# EAGLE design Christmas Tree 2.1 (EAGLE 9.6.2)
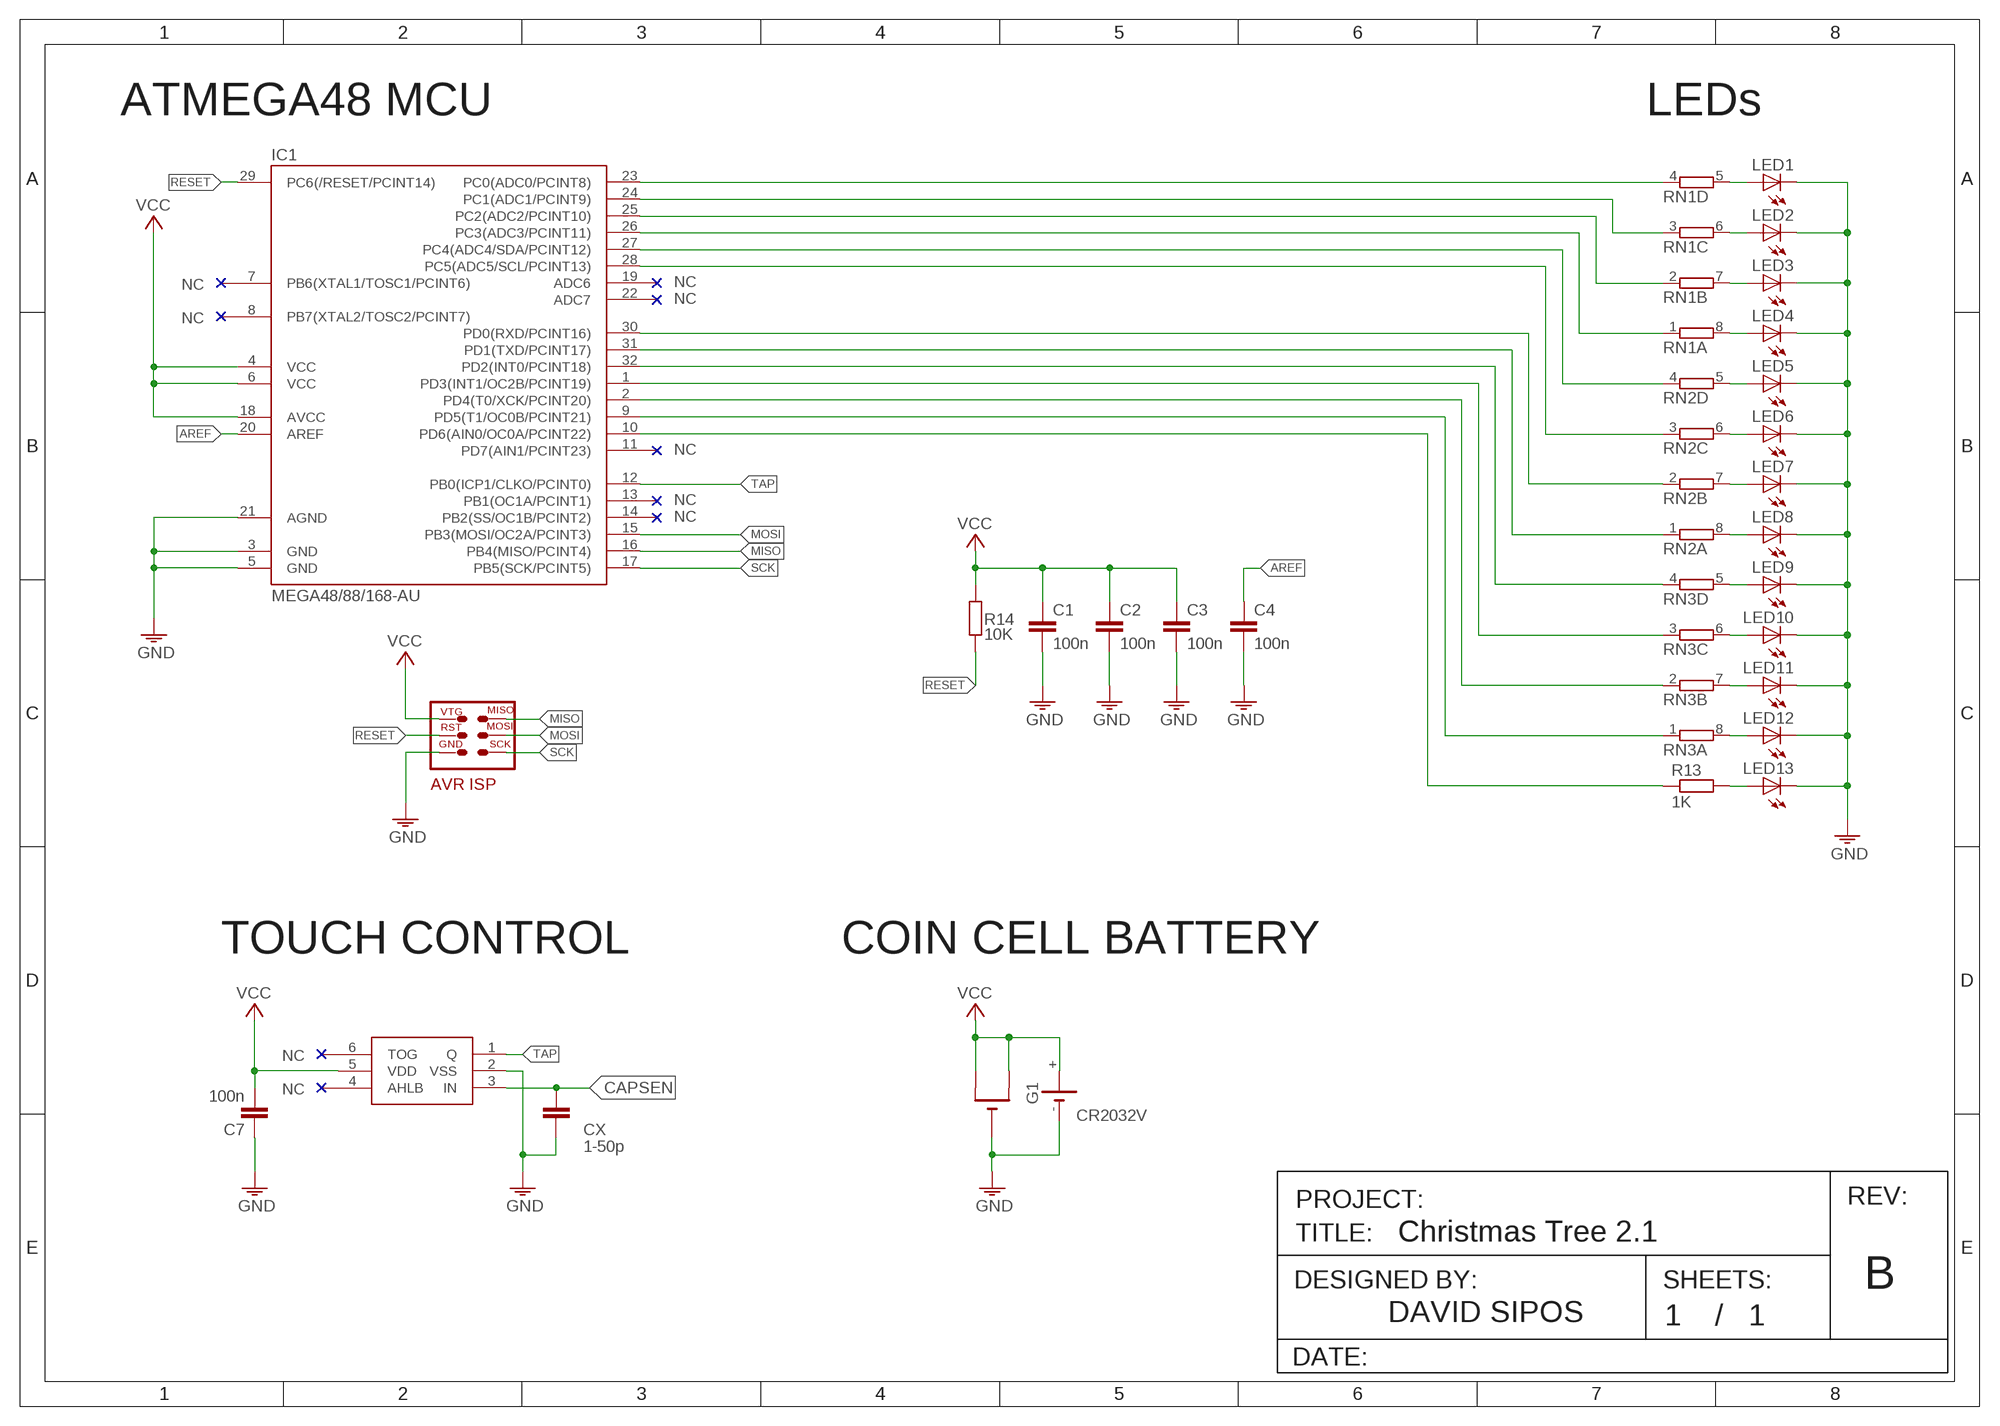
[diagram p0: schematic, sheet 1]

## Parts
BAT  CR2032SMT  [CR2032-SMD]
C1  100n  C-EUC0402K  [C0402K]
C2  100n  C-EUC0402K  [C0402K]
C3  100n  C-EUC0402K  [C0402K]
C4  100n  C-EUC0402K  [C0402K]
C7  100n  C-EUC0402K  [C0402K]
CX  1-50p  C-EUC0402K  [C0402K]
G1  CR2032V  [CR2032V]
IC1  MEGA48/88/168-AU  [TQFP32-08]
LED1  LEDCHIPLED_0805  [CHIPLED_0805]
LED2  LEDCHIPLED_0805  [CHIPLED_0805]
LED3  LEDCHIPLED_0805  [CHIPLED_0805]
LED4  LEDCHIPLED_0805  [CHIPLED_0805]
LED5  LEDCHIPLED_0805  [CHIPLED_0805]
LED6  LEDCHIPLED_0805  [CHIPLED_0805]
LED7  LEDCHIPLED_0805  [CHIPLED_0805]
LED8  LEDCHIPLED_0805  [CHIPLED_0805]
LED9  LEDCHIPLED_0805  [CHIPLED_0805]
LED10  LEDCHIPLED_0805  [CHIPLED_0805]
LED11  LEDCHIPLED_0805  [CHIPLED_0805]
LED12  LEDCHIPLED_0805  [CHIPLED_0805]
LED13  LEDCHIPLED_0805  [CHIPLED_0805]
R13  1K  R-EU_R0402  [R0402]
R14  10K  R-EU_R0402  [R0402]
RN1  4R-N0603-ARC  [0603-ARC]
RN2  4R-N0603-ARC  [0603-ARC]
RN3  4R-N0603-ARC  [0603-ARC]
TTP223E1  TTP223E  [SOT23-6]
U$12  ISP  [ISP]

## Nets
AREF: C4.1 IC1.20(AREF)
CAPSEN: CX.2 TTP223E1.3(IN)
GND: BAT.- C1.2 C2.2 C3.2 C4.2 C7.1 CX.1 G1.- IC1.3(GND) IC1.5(GND) IC1.21(AGND) LED1.C LED2.C LED3.C LED4.C LED5.C LED6.C LED7.C LED8.C LED9.C LED10.C LED11.C LED12.C LED13.C TTP223E1.2(VSS) U$12.6
MISO: IC1.16(PB4(MISO/PCINT4)) U$12.1
MOSI: IC1.15(PB3(MOSI/OC2A/PCINT3)) U$12.4
N$1: LED1.A RN1.5
N$2: LED2.A RN1.6
N$3: LED3.A RN1.7
N$4: LED4.A RN1.8
N$5: LED5.A RN2.5
N$6: LED6.A RN2.6
N$7: LED7.A RN2.7
N$8: LED8.A RN2.8
N$9: LED9.A RN3.5
N$10: LED10.A RN3.6
N$11: LED11.A RN3.7
N$12: LED12.A RN3.8
N$13: LED13.A R13.2
N$18: IC1.23(PC0(ADC0/PCINT8)) RN1.4
N$19: IC1.24(PC1(ADC1/PCINT9)) RN1.3
N$20: IC1.25(PC2(ADC2/PCINT10)) RN1.2
N$21: IC1.26(PC3(ADC3/PCINT11)) RN1.1
N$22: IC1.27(PC4(ADC4/SDA/PCINT12)) RN2.4
N$23: IC1.28(PC5(ADC5/SCL/PCINT13)) RN2.3
N$24: IC1.30(PD0(RXD/PCINT16)) RN2.2
N$25: IC1.31(PD1(TXD/PCINT17)) RN2.1
N$26: IC1.32(PD2(INT0/PCINT18)) RN3.4
N$27: IC1.1(PD3(INT1/OC2B/PCINT19)) RN3.3
N$28: IC1.2(PD4(T0/XCK/PCINT20)) RN3.2
N$29: IC1.9(PD5(T1/OC0B/PCINT21)) RN3.1
N$30: IC1.10(PD6(AIN0/OC0A/PCINT22)) R13.1
RESET: IC1.29(PC6(/RESET/PCINT14)) R14.1 U$12.5
SCK: IC1.17(PB5(SCK/PCINT5)) U$12.3
TAP: IC1.12(PB0(ICP1/CLKO/PCINT0)) TTP223E1.1(Q)
VCC: BAT.+$1(+) BAT.+$2(+1) C1.1 C2.1 C3.1 C7.2 G1.+ G1.+@1(+) IC1.4(VCC) IC1.6(VCC) IC1.18(AVCC) R14.2 TTP223E1.5(VDD) U$12.2
Unconnected: IC1.7(PB6(XTAL1/TOSC1/PCINT6)) IC1.8(PB7(XTAL2/TOSC2/PCINT7)) IC1.11(PD7(AIN1/PCINT23)) IC1.13(PB1(OC1A/PCINT1)) IC1.14(PB2(SS/OC1B/PCINT2)) IC1.19(ADC6) IC1.22(ADC7) TTP223E1.4(AHLB) TTP223E1.6(TOG)

## Notes on the sheet
- ATMEGA48 MCU | LEDs
- TOUCH CONTROL | COIN CELL BATTERY
- B

## Library data of the parts
BAT = adafruit:CR2032
C1-C4 C7 CX = rcl:C-EU: CAPACITOR, European symbol; SPICEPREFIX: C
G1 = battery:CR2032V: LI BATTERY Varta
IC1 = avr-6:MEGA48/88/168
LED1-LED13 = led:LED: LED OSRAM: - CHIPLED LG R971, LG N971, LY N971, LG Q971, LY Q971, LO R971, LY R971 LH N974, LH R974 LS Q976, LO Q976, LY Q976 LO Q996 - Hyper CHIPLED LW Q18S LB Q993, LB Q99A, LB R99A - SideLED LS A670, LO A670, LY A670, LG A670, LP A670 LB A673, LV A673, LT A673, LW A673 LH A674 LY A675 LS A676, LA A676, LO A676, LY A676, LW A676 LS A679, LY A679, LG A679 - Hyper Micro SIDELED® LS Y876, LA Y876, LO Y876, LY Y876 LT Y87S - SmartLED LW L88C, LW L88S LB L89C, LB L89S, LG L890 LS L89K, LO L89K, LY L89K LS L896, LA L896, LO L896, LY L896 - TOPLED LS T670, LO T670, LY T670, LG T670, LP T670 LSG T670, LSP T670, LSY T670, LOP T670, LYG T670 LG T671, LOG T671, LSG T671 LB T673, LV T673, LT T673, LW T673 LH T674 LS T676, LA T676, LO T676, LY T676, LB T676, LH T676, LSB T676, LW T676 LB T67C, LV T67C, LT T67C, LS T67K, LO T67K, LY T67K, LW E67C LS E67B, LA E67B, LO E67B, LY E67B, LB E67C, LV E67C, LT E67C LW T67C LS T679, LY T679, LG T679 LS T770, LO T770, LY T770, LG T770, LP T770 LB T773, LV T773, LT T773, LW T773 LH T774 LS E675, LA E675, LY E675, LS T675 LS T776, LA T776, LO T776, LY T776, LB T776 LHGB T686 LT T68C, LB T68C - Hyper Mini TOPLED® LB M676 - Mini TOPLED Santana® LG M470 LS M47K, LO M47K, LY M47K Source: http://www.osram.convergy.de LUXEON: - LUMILED® LXK2-PW12-R00, LXK2-PW12-S00, LXK2-PW14-U00, LXK2-PW14-V00 LXK2-PM12-R00, LXK2-PM12-S00, LXK2-PM14-U00 LXK2-PE12-Q00, LXK2-PE12-R00, LXK2-PE12-S00, LXK2-PE14-T00, LXK2-PE14-U00 LXK2-PB12-K00, LXK2-PB12-L00, LXK2-PB12-M00, LXK2-PB14-N00, LXK2-PB14-P00, LXK2-PB14-Q00 LXK2-PR12-L00, LXK2-PR12-M00, LXK2-PR14-Q00, LXK2-PR14-R00 LXK2-PD12-Q00, LXK2-PD12-R00, LXK2-PD12-S00 LXK2-PH12-R00, LXK2-PH12-S00 LXK2-PL12-P00, LXK2-PL12-Q00, LXK2-PL12-R00 Source: www.luxeon.com KINGBRIGHT: KA-3528ASYC Source: www.kingbright.com
R13 R14 = rcl:R-EU_: RESISTOR, European symbol; SPICEPREFIX: R
RN1-RN3 = resistor-dil:4R-N: Array Chip Resistor Source: RS Component / Phycomp; OC_FARNELL: unknown; OC_NEWARK: unknown
TTP223E1 = MCU:TTP223E
U$12 = MCU:ISP

## Board
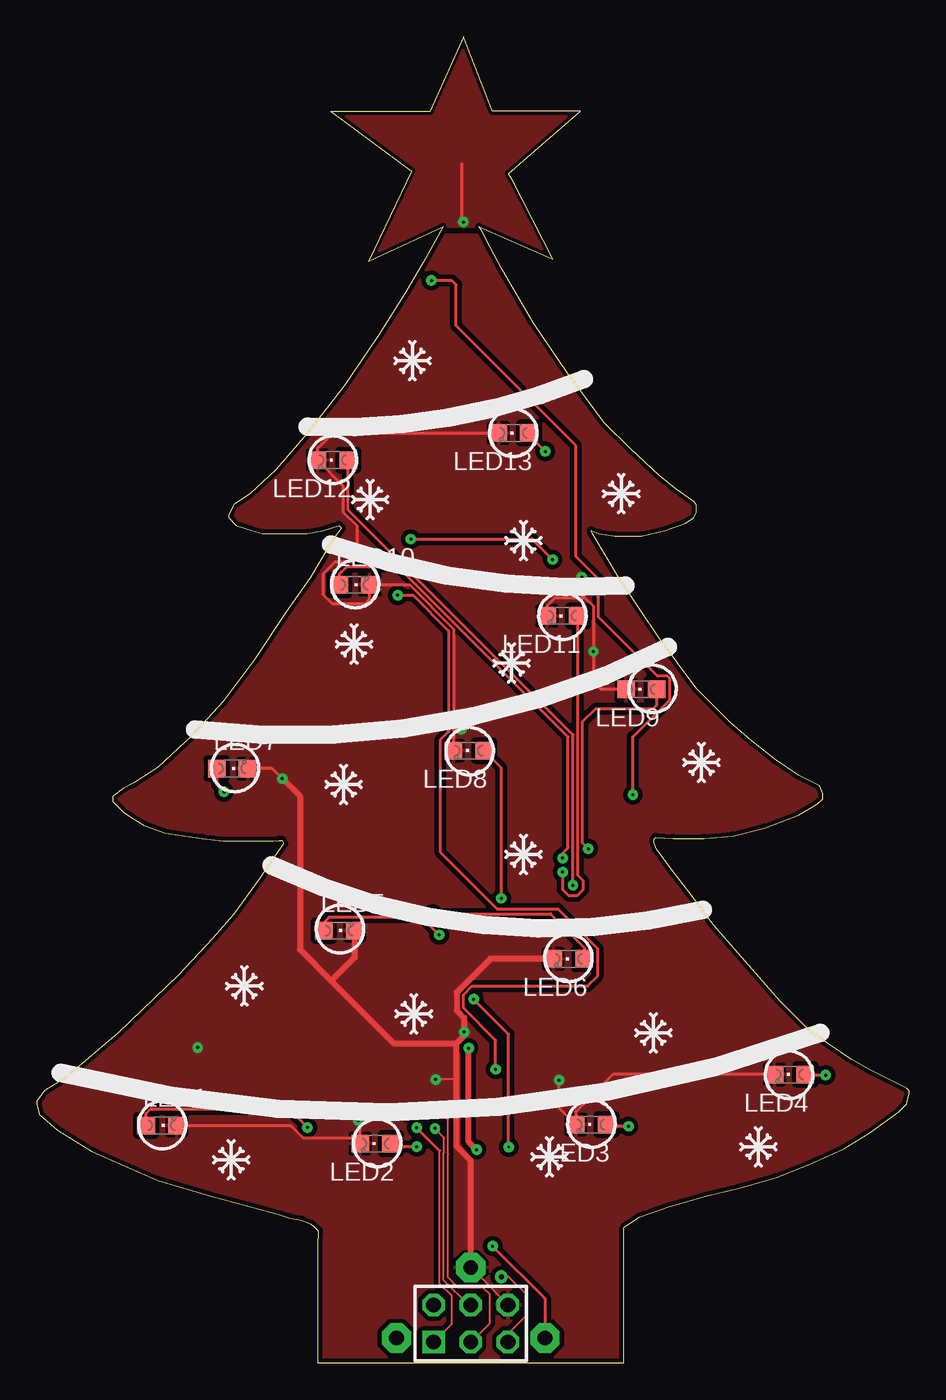
[diagram p1: board, top side]
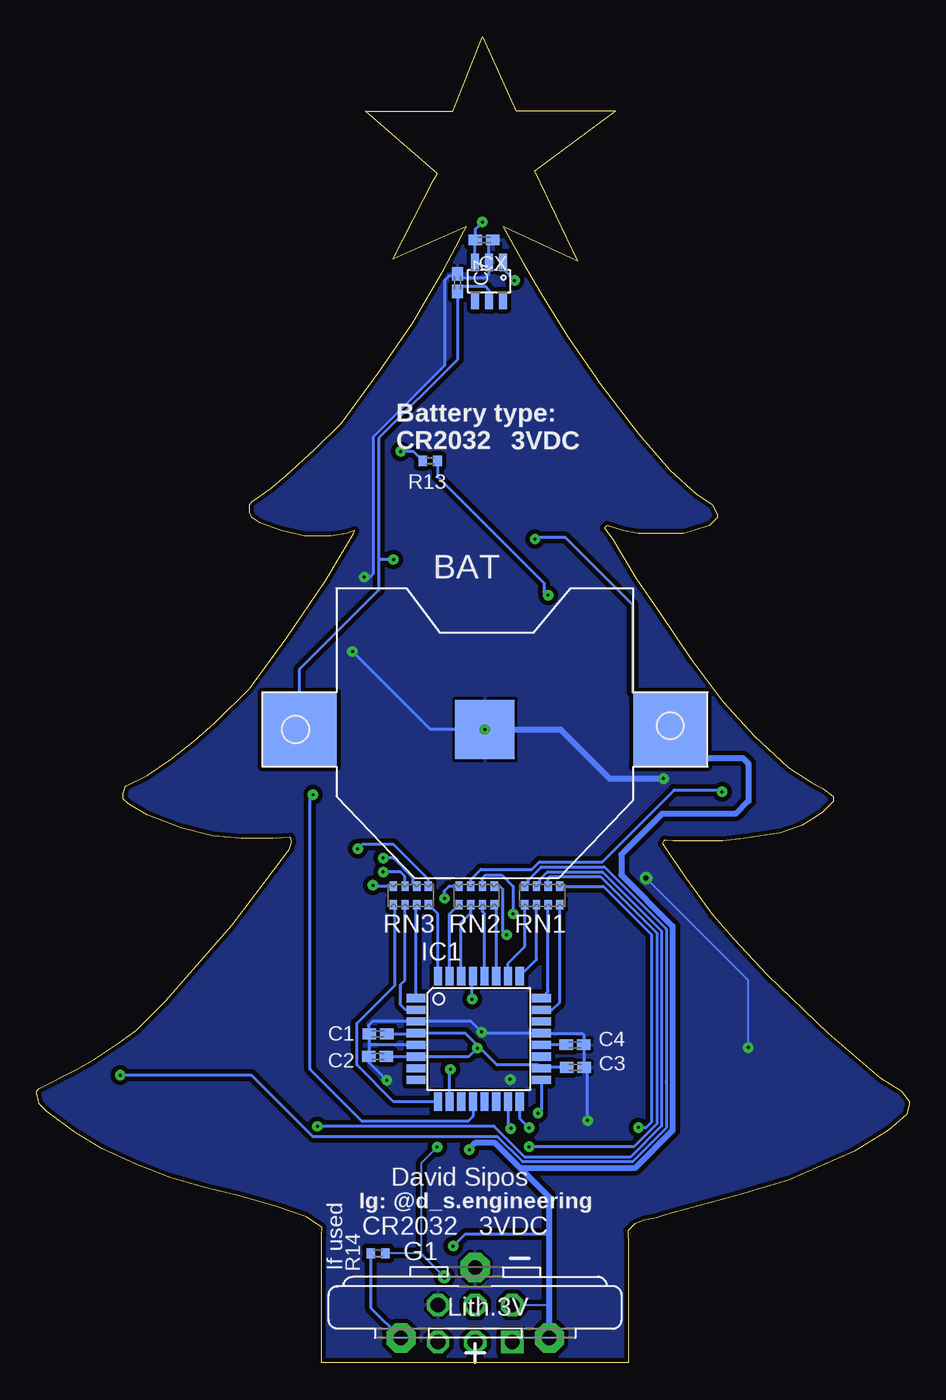
[diagram p2: board, bottom side, seen from below]

Size 59.76 x 90.8 mm. Coordinates in mm from the lower left corner, seen from the top.
Outline: 40.23,0 40.23,8.75 40.22,9.27 41.32,9.99 43.38,10.71 45.9,11.43 48.06,11.97 50.58,12.69 52.92,13.59 55.26,14.67 57.06,15.75 59.04,17.19 59.58,17.73 59.76,18.45 59.76,18.63 59.58,18.81 57.06,20.07 55.8,20.79 54.18,21.87 52.92,22.77 50.94,24.75 46.36,30 44.77,32.12 43.48,33.78 42.43,35.2 42.28,35.65 42.31,35.9 42.4,35.98 43.56,35.91 45.72,35.91 47.7,36.09 49.86,36.63 52.2,37.53 53.46,38.25 53.82,38.61 53.82,38.97 53.64,39.51 52.2,40.23 50.58,41.31 48.96,42.57 47.52,43.83 45.18,46.17 42.66,49.59 39.96,53.55 38.05,56.79 37.98,56.97 38.52,56.79 39.6,56.61 41.4,56.61 43.02,56.97 44.46,57.51 45,57.87 45.18,58.23 45.18,58.77 45,58.95 43.74,59.85 42.66,60.75 40.68,62.55 38.88,64.35 36.36,67.77 34.02,71.19 31.86,74.86 31.03,76.41 30.49,77.49 30.31,77.78 35.36,75.56 32.57,80.95 32.31,81.4 37.23,85.7 31.23,85.7 29.23,90.8 26.93,85.7 20.13,85.7 25.68,81.57 22.74,75.44 27.83,77.78 26.46,75.33 25.2,73.17 23.4,70.29 21.06,66.87 18.54,63.63 16.38,61.11 14.58,59.49 13.5,58.77 13.14,58.05 13.14,57.87 13.68,57.33 14.76,56.97 15.48,56.79 18.54,56.79 19.62,56.97 20.7,57.33 20.88,57.15 20.34,56.43 18.72,53.73 17.1,51.39 14.94,48.15 12.78,45.27 10.62,42.93 8.28,40.77 6.66,39.69 5.94,39.33 5.22,38.79 5.22,38.43 5.94,37.71 6.48,37.35 7.38,36.81 8.82,36.27 11.34,35.91 12.78,35.73 16.2,35.73 16.6,35.78 16.8,35.77 16.92,35.55 15.3,33.21 13.5,30.69 12.06,29.07 9.72,26.55 5.58,22.59 1.98,19.53 0.54,18.63 0,17.91 0,17.73 0.18,17.01 1.44,15.93 3.78,14.49 8.28,12.51 11.88,11.43 16.56,10.17 17.3,9.95 18.17,9.77 18.78,9.52 18.96,9.34 19.28,9.05 19.23,8 19.23,0 40.23,0
Copper layers (1*16): Top 0.035mm / dielectric 0.73mm / Bottom 0.035mm
Design rules "JLCPCB": minimum track width 5mil, minimum drill 0.2mm, track to track 5mil, track to pad 0.2mm, pad to pad 5mil, via to via 10mil, smd to smd 5mil, copper to edge 10mil, drill to drill 10mil, minimum pad ring 10mil, minimum via ring 10mil, stop-mask expansion 4mil, vias tented up to drill 4mil, thermal gap 8mil

### Footprints (pad centres in the part's own frame; a part is rotated, then mirrored left to right if it is on the bottom)
CR2032-SMD = smd 5.08 x 5.08: +$1 -12.7,0; +$2 12.7,0 | smd 4.064 x 4.064: - 0,0
C0402K = smd 0.925 x 0.74: 1 -0.6,0; 2 0.6,0
CR2032V = drill 1 pad 2 octagon: + -2.54,-5.08; +@1 -2.54,5.08; - 2.286,0
TQFP32-08 = smd 1.27 x 0.559: 1 -4.293,2.8; 2 -4.293,2; 3 -4.293,1.2; 4 -4.293,0.4; 5 -4.293,-0.4; 6 -4.293,-1.2; 7 -4.293,-2; 8 -4.293,-2.8; 17 4.293,-2.8; 18 4.293,-2; 19 4.293,-1.2; 20 4.293,-0.4; 21 4.293,0.4; 22 4.293,1.2; 23 4.293,2; 24 4.293,2.8 | smd 0.559 x 1.27: 9 -2.8,-4.293; 10 -2,-4.293; 11 -1.2,-4.293; 12 -0.4,-4.293; 13 0.4,-4.293; 14 1.2,-4.293; 15 2,-4.293; 16 2.8,-4.293; 25 2.8,4.293; 26 2,4.293; 27 1.2,4.293; 28 0.4,4.293; 29 -0.4,4.293; 30 -1.2,4.293; 31 -2,4.293; 32 -2.8,4.293
CHIPLED_0805 = smd 1.2 x 1.2: A 0,-1.05; C 0,1.05
R0402 = smd 0.6 x 0.7: 1 -0.5,0; 2 0.5,0
0603-ARC = smd 0.5 x 0.65: 1 -1.2,-0.625; 2 -0.4,-0.625; 3 0.4,-0.625; 4 1.2,-0.625; 5 1.2,0.625; 6 0.4,0.625; 7 -0.4,0.625; 8 -1.2,0.625
SOT23-6 = smd 0.55 x 1.2: 1 -0.95,-1.3; 2 0,-1.3; 3 0.95,-1.3; 4 0.95,1.3; 5 0,1.3; 6 -0.95,1.3
ISP = drill 1.016 square: 1 -2.54,-1.27 | drill 1.016 octagon: 2 -2.54,1.27; 3 0,-1.27; 4 0,1.27; 5 2.54,-1.27; 6 2.54,1.27

### Placement (x,y rotation side)
BAT  29.07,43.37 0 bottom
C1  36.39,22.53 180 bottom
C2  36.4,20.99 180 bottom
C3  22.87,20.22 0 bottom
C4  22.88,21.79 0 bottom
C7  30.93,73.94 270 bottom
CX  29.11,76.87 180 bottom
G1  29.73,4.25 90 bottom
IC1  29.48,22.17 0 bottom
LED1  8.56,16.26 270 top
LED2  23.21,15.02 90 top
LED3  37.97,16.32 90 top
LED4  51.58,19.74 90 top
LED5  20.73,29.6 270 top
LED6  36.44,27.67 90 top
LED7  13.39,40.69 270 top
LED8  29.59,41.91 90 top
LED9  41.41,46.12 90 top
LED10  21.77,53.27 270 top
LED11  36.01,51.14 90 top
LED12  20.28,61.8 90 top
LED13  32.67,63.66 90 top
R13  32.81,61.75 180 bottom
R14  36.38,7.51 180 bottom
RN1  25.13,32 0 bottom
RN2  29.63,32 0 bottom
RN3  34.13,32 0 bottom
TTP223E1  28.78,74.04 180 bottom
U$12  29.73,2.7 0 top

### Tracks (layer width: path | path; a pad name or v marks a point on that pad's centre or on a via)
AREF
  Bottom 0.203: C4.1 25.18,21.79 IC1.20
CAPSEN  (via drill 0.2)
  Top 0.203: v29.23,78.1 29.13,78.2 29.13,82.1
  Bottom 0.203: TTP223E1.3 29.73,76.85 CX.2 29.71,77.62 v29.23,78.1
  pour Top: 30.53,77.8 27.83,77.8 22.79,74.78 19.93,85.7 29.23,91.4 37.73,85.7 35.5,74.66
GND  (via drill 0.2, 0.35)
  Top 0.152: U$12.6 32.27,4 G1.- | 28.77,19.5 28.67,19.4 v27.33,19.4
  Top 0.203: LED1.C 17.4,16.26 18.25,15.41 21.77,15.41 LED2.C 22.16,16.47 v22.03,16.6 | v35.78,19.35 35.78,17.46 LED3.C 36.92,17.19 39.47,19.74 LED4.C | v16.83,40 16.14,40.69 LED7.C | 28.54,43.3 28.54,50.25 25.53,53.27 LED10.C 22.82,52.29 22.53,52 20.23,52 19.62,52.61 19.62,53.99 20.45,54.83 21.56,54.83 21.93,55.2 21.93,57.33 21,58.26 21,60.03 LED12.C 19.23,62.6 20.29,63.66 LED13.C | 28.54,43.3 LED8.C | BAT.- 29,43.3 28.54,43.3 | LED11.C 34.96,51.83 35.53,52.4 37.53,52.4 | 37.53,52.4 38.13,51.8 v38.13,48.7 38.13,46.6 38.61,46.12 LED9.C | v37.33,53.8 37.33,52.6 37.53,52.4
  Top 0.406: G1.- 29.73,13.85 28.77,14.81 28.77,19.5 28.77,21.89 | 28.77,21.89 29.28,22.4 v29.28,22.65 29.28,23.64 28.79,24.13 28.79,25.37 31.08,27.67 LED6.C | v16.83,40 18.03,38.8 v18.03,33.2 18.03,28.3 20.18,26.15 | 20.18,26.15 24.44,21.89 28.77,21.89 | LED5.C 21.78,27.75 20.18,26.15
  Bottom 0.152: v11.03,21.6 11.03,26.2 v18.03,33.2
  Bottom 0.203: 37,21.8 C1.2 37.03,22.57 37.03,23.1 36.76,23.37 IC1.3 33.75,23.4 30.03,23.4 v29.28,22.65 29.2,22.57 IC1.21 22.4,22.57 22.28,22.45 C4.2 22.28,20.24 C3.2 22.03,19.99 v22.03,16.6 | 37,21.8 C2.2 37,20.57 v35.78,19.35 | IC1.5 36.97,21.77 37,21.8 | CX.1 28.78,76.6 TTP223E1.2 28.78,74.55 29.03,74.3 30.69,74.3 C7.1 31.07,74.4 31.53,74.4 31.83,74.1 31.83,68.27 36.73,63.37 36.73,54 36.93,53.8 v37.33,53.8 | BAT.- 32.8,43.37 v38.13,48.7
  Bottom 0.406: BAT.- 23.9,43.37 20.53,40 v16.83,40
  other vias: 29.07,43.37
  pour Bottom (isolate 0.305): -4.77,-4.1 63.43,-4.1 63.43,70.6 37.63,70.6 31.03,77.2 27.33,77.2 21.23,71.1 -4.77,71.1
  pour Top (isolate 0.305): -4.77,-3.8 63.43,-3.8 63.43,70.6 37.63,70.6 31.03,77.2 27.33,77.2 21.23,71.1 -4.77,71.1
MISO  (via drill 0.2)
  Top 0.152: U$12.1 28.43,2.67 28.43,4.6 27.6,5.43 27.6,14.53
  Top 0.203: 27.6,14.53 v26.03,16.1
  Bottom 0.203: IC1.16 26.68,16.75 v26.03,16.1
MOSI  (via drill 0.2)
  Top 0.152: U$12.4 29.56,3.97 27.88,5.65 27.88,14.38 27.91,14.4 27.91,15.43 v27.28,16.05
  Bottom 0.203: IC1.15 27.48,16.25 v27.28,16.05
N$1  (via drill 0.2)
  Top 0.203: LED1.A 7.51,17.08 7.83,17.4 17.27,17.4 v18.55,16.12
  Bottom 0.203: RN1.5 20.96,32.62 17.63,29.3 17.63,16.5 18.01,16.12 v18.55,16.12
N$2  (via drill 0.2)
  Top 0.203: v26.03,14.8 24.48,14.8 LED2.A
  Bottom 0.203: RN1.6 24.73,33.2 24.63,33.3 21.16,33.3 17.3,29.44 17.3,16.36 18.86,14.8 v26.03,14.8
N$3  (via drill 0.2)
  Top 0.203: v40.53,16.2 39.14,16.2 LED3.A
  Bottom 0.203: RN1.7 25.28,32.87 25.28,33.12 24.77,33.63 21.03,33.63 16.97,29.57 16.97,16.23 19.11,14.09 26.32,14.09 28.44,16.2 v40.53,16.2
N$4  (via drill 0.2)
  Top 0.203: v54.03,19.7 52.67,19.7 LED4.A
  Bottom 0.203: RN1.8 26.08,32.87 26.08,33.08 25.2,33.96 20.89,33.96 16.64,29.71 16.64,19.3 16.64,19.2 16.64,16.09 18.97,13.76 26.46,13.76 28.19,15.49 40.82,15.49 45.04,19.7 v54.03,19.7
N$5  (via drill 0.2)
  Top 0.203: v27.57,29.3 26.37,30.5 20.03,30.5 19.68,30.15 LED5.A
  Bottom 0.203: RN2.5 28.03,32.62 27.87,32.47 27.87,29.6 v27.57,29.3
N$6  (via drill 0.2)
  Top 0.203: v27.13,30.74 35.19,30.74 37.53,28.4 37.53,27.71 LED6.A
  Bottom 0.203: RN2.6 29.23,33.2 29.03,33.4 27.9,33.4 27.13,32.63 v27.13,30.74
N$7  (via drill 0.2)
  Top 0.203: v12.83,39.1 12.34,39.59 LED7.A
  Bottom 0.203: RN2.7 30.03,33.1 29.33,33.8 25.82,33.8 25.32,34.3 21.03,34.3 16.1,39.23 12.96,39.23 v12.83,39.1
N$8  (via drill 0.2)
  Top 0.203: v31.83,31.8 31.83,40.73 LED8.A
  Bottom 0.203: RN2.8 31.53,32.62 31.83,32.33 v31.83,31.8
N$9  (via drill 0.2)
  Top 0.203: v37.77,35.2 37.39,35.58 37.39,43.9 38.29,44.8 42.23,44.8 42.46,45.03 LED9.A
  Bottom 0.203: RN3.5 32.93,33.1 35.33,35.5 37.47,35.5 v37.77,35.2
N$10  (via drill 0.2)
  Top 0.203: v36.02,34.56 36.02,34.89 36.4,35.27 36.4,42.86 24.76,54.5 21.23,54.5 20.72,53.99 LED10.A
  Bottom 0.203: RN3.6 33.98,32.87 33.98,33.22 35.33,34.56 v36.02,34.56
N$11  (via drill 0.2)
  Top 0.203: v36.02,33.6 36.02,32.41 36.43,31.99 37.02,31.99 37.44,32.41 37.44,32.99 37.06,33.38 LED11.A
  Bottom 0.203: RN3.7 34.53,33.3 34.83,33.6 v36.02,33.6
N$12  (via drill 0.2)
  Top 0.203: v36.73,32.7 36.73,43 21.33,58.4 LED12.A
  Bottom 0.203: RN3.8 36.65,32.62 v36.73,32.7
N$13  (via drill 0.2)
  Top 0.203: v34.83,62.4 33.72,63.51 LED13.A
  Bottom 0.203: R13.2 33.96,62.4 v34.83,62.4
N$18
  Bottom 0.203: IC1.23 24.46,24.17 23.93,24.7 RN1.4
N$19
  Bottom 0.203: IC1.24 24.73,25.43 RN1.3
N$20
  Bottom 0.203: IC1.25 25.53,27.62 RN1.2
N$21
  Bottom 0.203: IC1.26 27.48,27.35 26.33,28.5 RN1.1
N$22
  Bottom 0.203: IC1.27 28.28,31.23 RN2.4
N$23
  Bottom 0.203: RN2.3 29.23,30.9 29.08,30.75 IC1.28
N$24
  Bottom 0.203: RN2.2 30.03,30.8 30.68,30.15 IC1.30
N$25
  Bottom 0.203: IC1.31 31.48,30.72 RN2.1
N$26
  Bottom 0.203: IC1.32 32.28,30.73 RN3.4
N$27
  Bottom 0.203: IC1.1 33.77,31.33 RN3.3
N$28
  Bottom 0.203: IC1.2 34.5,24.17 34.83,24.5 34.83,25.9 34.53,26.2 RN3.2
N$29
  Bottom 0.203: IC1.9 35.31,17.88 37.83,20.4 37.83,23.25 35.23,25.86 35.23,31.27 RN3.1
N$30  (via drill 0.2)
  Top 0.203: v24.73,52.56 25.77,52.56 28.21,50.12 28.21,43.21 27.64,42.64 27.64,34.98 31.54,31.09 35.69,31.09 38.43,28.35 38.43,26.5 37.73,25.8 29.82,25.8 29.22,25.2 29.22,24.31 31.43,22.1 v31.43,20.1
  Bottom 0.203: R13.1 32.31,60.68 25.03,53.4 25.03,52.8 24.79,52.56 v24.73,52.56 | IC1.10 31.48,20.05 v31.43,20.1
RESET  (via drill 0.2, 0.35)
  Top 0.152: U$12.5 32.27,2 33.61,3.34 33.61,4.62 32.33,5.9 v31.83,5.9
  Top 0.203: v32.33,14.78 32.33,22.5 v29.93,24.9
  Bottom 0.152: R14.1 33.48,7.51 31.87,5.9 v31.83,5.9 33.43,7.5 33.43,13.68 v32.33,14.78
  Bottom 0.203: v29.93,24.9 29.93,26.42 IC1.29
SCK  (via drill 0.2)
  Top 0.152: U$12.3 31.03,2.73 31.03,4.7 30.57,5.16 28.87,5.16 28.16,5.87 28.16,14.26 28.18,14.29 28.18,16.65 27.73,17.1 v25.43,17.1
  Bottom 0.203: IC1.17 25.19,17.34 v25.43,17.1
TAP  (via drill 0.2)
  Top 0.203: v40.83,38.9 40.83,42.86 43.36,45.39 43.36,46.84 43.19,47.02 42.51,47.02 38.46,51.07 38.46,53.68 36.93,55.21 36.93,62.8 28.73,71 28.73,73.8 28.43,74.1 v27.03,74.1
  Bottom 0.203: IC1.12 29.88,16.88 30.23,16.53 37.46,16.53 41.03,20.1 41.03,38.6 40.83,38.8 v40.83,38.9 | v27.03,74.1 27.83,74.9 TTP223E1.1
VCC  (via drill 0.2)
  Top 0.203: v25.63,56.4 33.93,56.4 v35.33,55 | v31.23,8 34.81,4.42 G1.+@1
  Top 0.406: v30.13,14.6 29.58,15.15 v29.58,21.55
  Bottom 0.152: U$12.2 24.72,3.97 24.65,3.9
  Bottom 0.203: C3.1 25.14,20.23 IC1.18 25.41,20.39 28.22,20.39 29.48,21.65 | C2.1 33.79,20.99 IC1.6 30.16,20.97 v29.58,21.55 29.48,21.65 | C1.1 33.81,22.54 IC1.4 30.4,22.57 29.48,21.65 | R14.2 36.88,3.78 G1.+@1 | TTP223E1.5 28.78,73.45 29.03,73.7 30.57,73.7 C7.2 30.93,68.7 36.33,63.3 36.33,55 | BAT.+$1 41.77,47.46 36.33,52.9 36.33,55 | BAT.+$2 18.93,45.93 18.93,51.9 23.53,56.5 25.63,56.5 v25.63,56.4 | v35.33,55 36.33,55 | 24.65,8.8 30.43,8.8 v31.23,8
  Bottom 0.406: G1.+ 24.65,3.9 24.65,8.8 24.65,11.34 26.62,13.31 | 26.62,13.31 28.37,15.06 29.73,15.06 30.13,14.66 v30.13,14.6 | BAT.+$2 14.41,41.41 11.39,41.41 11.02,41.04 11.02,38.46 11.89,37.59 16.94,37.59 19.73,34.8 19.73,33.41 16.21,29.89 16.21,15.91 18.79,13.33 26.6,13.33 26.62,13.31

### Text on the board
_bsilk: 3VDC | Battery type: / CR2032 | David Sipos | Ig: @d_s.engineering | CR2032 3VDC | If used